# EAGLE design Retro_Lite_CM5_Left_PCB_v1 - RP2040 (EAGLE 9.6.1)
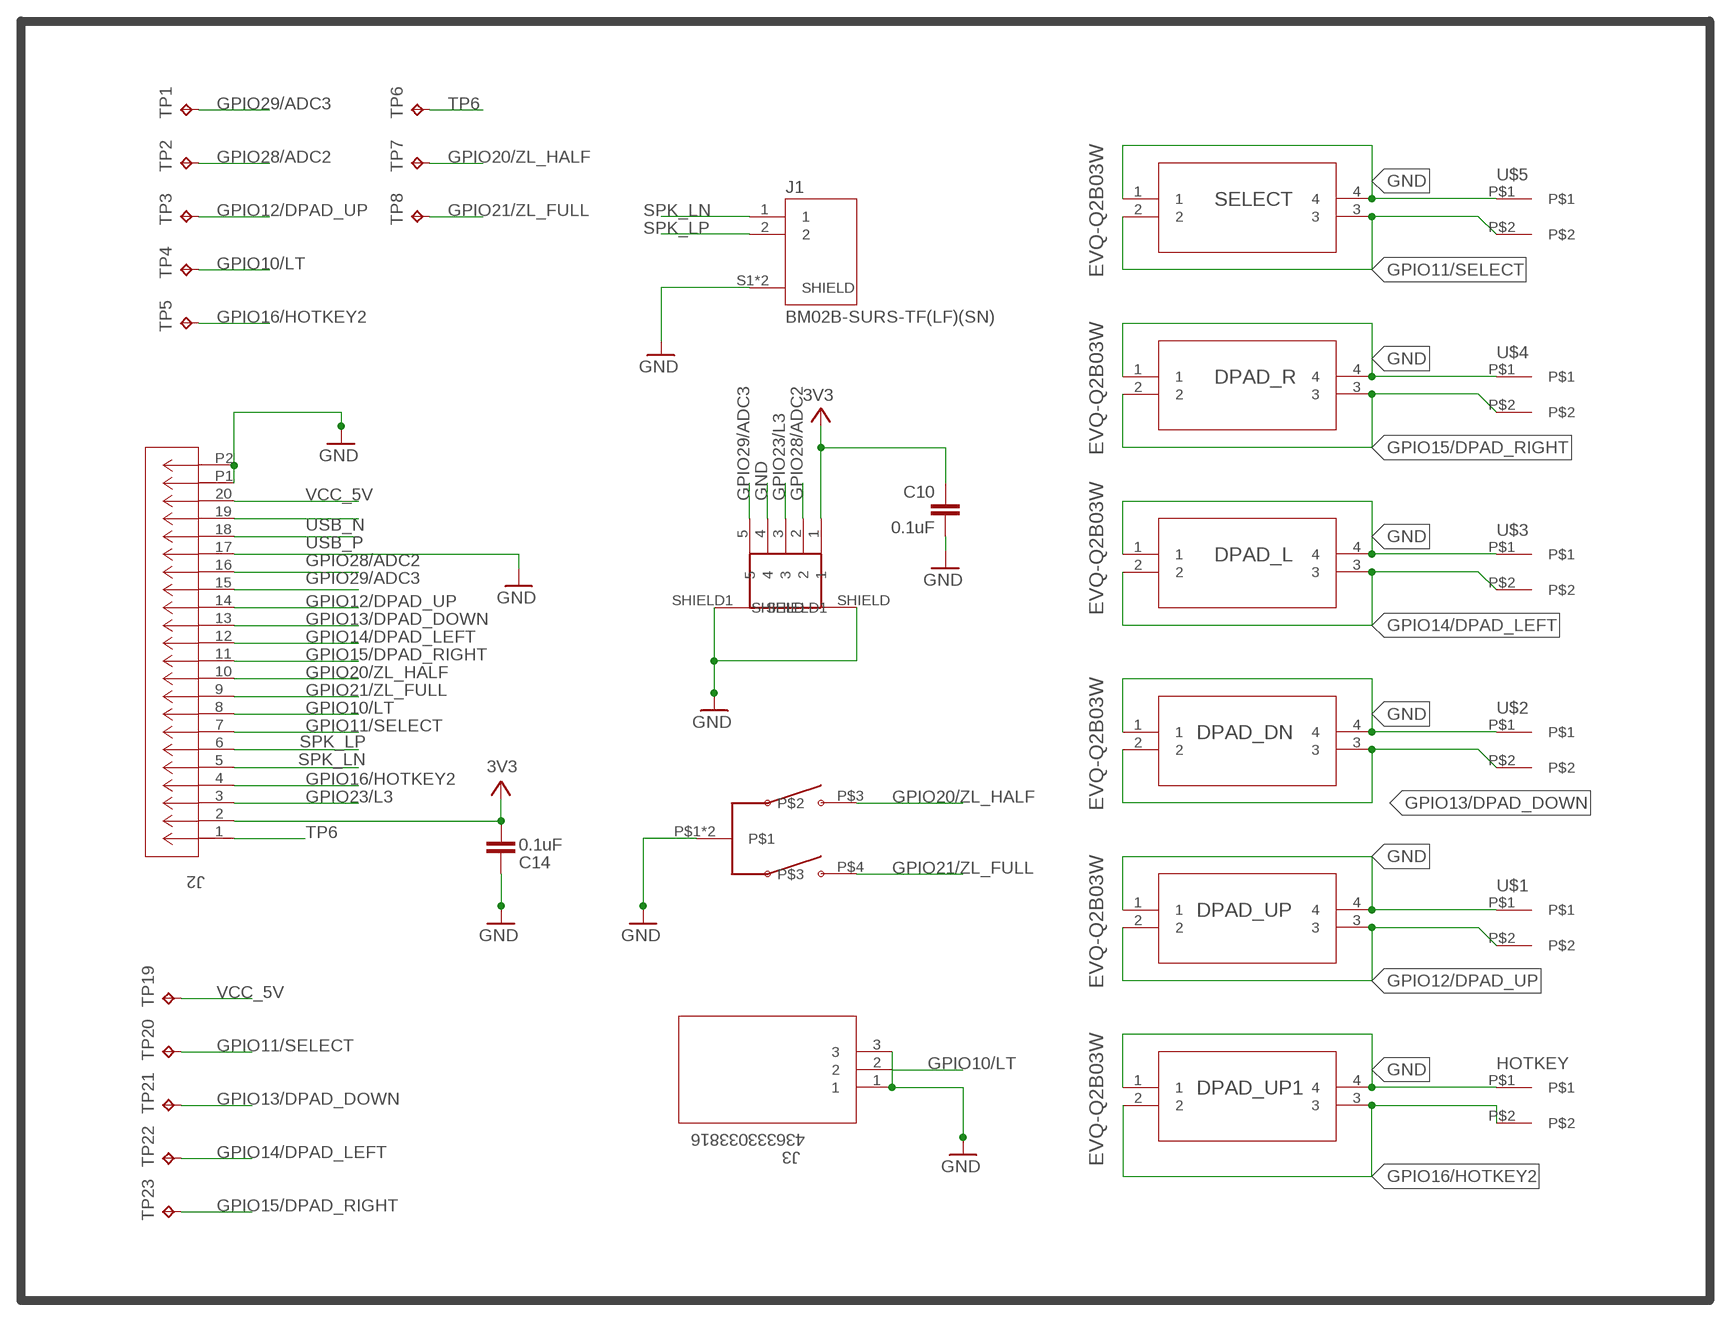
[diagram p0: schematic, sheet 1]

## Parts
C10  0.1uF  C-EUC0402-YVELTAL  [C0402]
C14  0.1uF  C-EUC0402-YVELTAL  [C0402]
DPAD_DN  EVQ-Q2B03W  [EVQQ2_3]
DPAD_L  EVQ-Q2B03W  [EVQQ2_3]
DPAD_R  EVQ-Q2B03W  [EVQQ2_3]
DPAD_UP  EVQ-Q2B03W  [EVQQ2_3]
DPAD_UP1  EVQ-Q2B03W  [EVQQ2_3]
HOTKEY  MEMBRANEBUTTON  [MEMBRANEBUTTON]
J1  BM02B-SURS-TF(LF)(SN)  [JST_BM02B-SURS-TF(LF)(SN)]
J2  5034802000  [CON_5034802000_MOL]
J3  436333033816  [CONN3_3033816_WRE]
SELECT  EVQ-Q2B03W  [EVQQ2_3]
TP1  TPTP07R  [TP07R]
TP2  TPTP07R  [TP07R]
TP3  TPTP07R  [TP07R]
TP4  TPTP07R  [TP07R]
TP5  TPTP07R  [TP07R]
TP6  TPTP07R  [TP07R]
TP7  TPTP07R  [TP07R]
TP8  TPTP07R  [TP07R]
TP19  TPTP07R  [TP07R]
TP20  TPTP07R  [TP07R]
TP21  TPTP07R  [TP07R]
TP22  TPTP07R  [TP07R]
TP23  TPTP07R  [TP07R]
U$1  MEMBRANEBUTTON  [MEMBRANEBUTTON]
U$2  MEMBRANEBUTTON  [MEMBRANEBUTTON]
U$3  MEMBRANEBUTTON  [MEMBRANEBUTTON]
U$4  MEMBRANEBUTTON  [MEMBRANEBUTTON]
U$5  MEMBRANEBUTTON  [MEMBRANEBUTTON]
U$7  SWITCHSTICK_BREAKOUT  [SWITCHSTICK_BREAKOUT]
U$8  TMHF07  [TMHF07]

## Nets
3V3: C10.1 C14.2 J2.2 U$7.1 ; supply symbol labelled VCC
GND: C10.2 C14.1 DPAD_DN.1 DPAD_DN.4 DPAD_L.1 DPAD_L.4 DPAD_R.1 DPAD_R.4 DPAD_UP1.1 DPAD_UP1.4 DPAD_UP.1 DPAD_UP.4 HOTKEY.P$1 J1.S1(SHIELD) J1.S2(SHIELD) J2.17 J2.P1 J2.P2 J3.1 J3.3 SELECT.1 SELECT.4 U$1.P$1 U$2.P$1 U$3.P$1 U$4.P$1 U$5.P$1 U$7.4 U$7.SHIELD U$7.SHIELD1 U$8.P$1 U$8.P$2
GPIO10/LT: J2.8 J3.2 TP4.TP
GPIO11/SELECT: J2.7 SELECT.2 SELECT.3 TP20.TP U$5.P$2
GPIO12/DPAD_UP: DPAD_UP.2 DPAD_UP.3 J2.14 TP3.TP U$1.P$2
GPIO13/DPAD_DOWN: DPAD_DN.2 DPAD_DN.3 J2.13 TP21.TP U$2.P$2
GPIO14/DPAD_LEFT: DPAD_L.2 DPAD_L.3 J2.12 TP22.TP U$3.P$2
GPIO15/DPAD_RIGHT: DPAD_R.2 DPAD_R.3 J2.11 TP23.TP U$4.P$2
GPIO16/HOTKEY2: DPAD_UP1.2 DPAD_UP1.3 HOTKEY.P$2 J2.4 TP5.TP
GPIO20/ZL_HALF: J2.10 TP7.TP U$8.P$3
GPIO21/ZL_FULL: J2.9 TP8.TP U$8.P$4
GPIO23/L3: J2.3 U$7.3
GPIO28/ADC2: J2.16 TP2.TP U$7.2
GPIO29/ADC3: J2.15 TP1.TP U$7.5
SPK_LN: J1.1 J2.5
SPK_LP: J1.2 J2.6
TP6: J2.1 TP6.TP
USB_N [USB2.0]: J2.19
USB_P [USB2.0]: J2.18
VCC_5V: J2.20 TP19.TP

## Library data of the parts
C10 C14 = rcl:C-EU: CAPACITOR, European symbol
DPAD_DN DPAD_L DPAD_R DPAD_UP DPAD_UP1 SELECT = EVQ-Q2B03W:EVQ-Q2B03W; AVAILABILITY: Unavailable; DESCRIPTION: Tactile Switch SPST-NO Top Actuated Surface Mount; MF: Panasonic Electronic; MP: EVQQ2B03W; PACKAGE: None; PRICE: None
HOTKEY U$1-U$5 = Membrane Button:MEMBRANEBUTTON
J1 = BM02B-SURS-TF_LF__SN_:BM02B-SURS-TF(LF)(SN): Connector Header Surface Mount 2 position 0.031" (0.80mm); CHECK_PRICES: https://www.snapeda.com/parts/BM02B-SURS-TF(LF)(SN)/JST+Sales+America+Inc./view-part/?ref=eda; DESCRIPTION: Connector Header Surface Mount 2 position 0.031 (0.80mm); MF: JST Sales; MP: BM02B-SURS-TF(LF)(SN); PACKAGE: None; SNAPEDA_LINK: https://www.snapeda.com/parts/BM02B-SURS-TF(LF)(SN)/JST+Sales+America+Inc./view-part/?ref=snap
J2 = 5034801700:5034802000; COPYRIGHT: Copyright (C) 2023 Ultra Librarian. All rights reserved.; MANUFACTURER_PART_NUMBER: 5034802000; MFR_NAME: Molex Connector Corporation
J3 = 5034801700:436333033816; COPYRIGHT: Copyright (C) 2023 Ultra Librarian. All rights reserved.; MANUFACTURER_PART_NUMBER: 436333033816; MFR_NAME: Wurth Electronics
TP1-TP8 TP19-TP23 = testpad:TP: Test pad
U$7 = My_Stuff:SWITCHSTICK_BREAKOUT
U$8 = tmhf07:TMHF07

## Net classes
1 USB2.0: width 0.192 mm, clearance 0.114 mm
2 USBEXT: width 0.254 mm

## Board
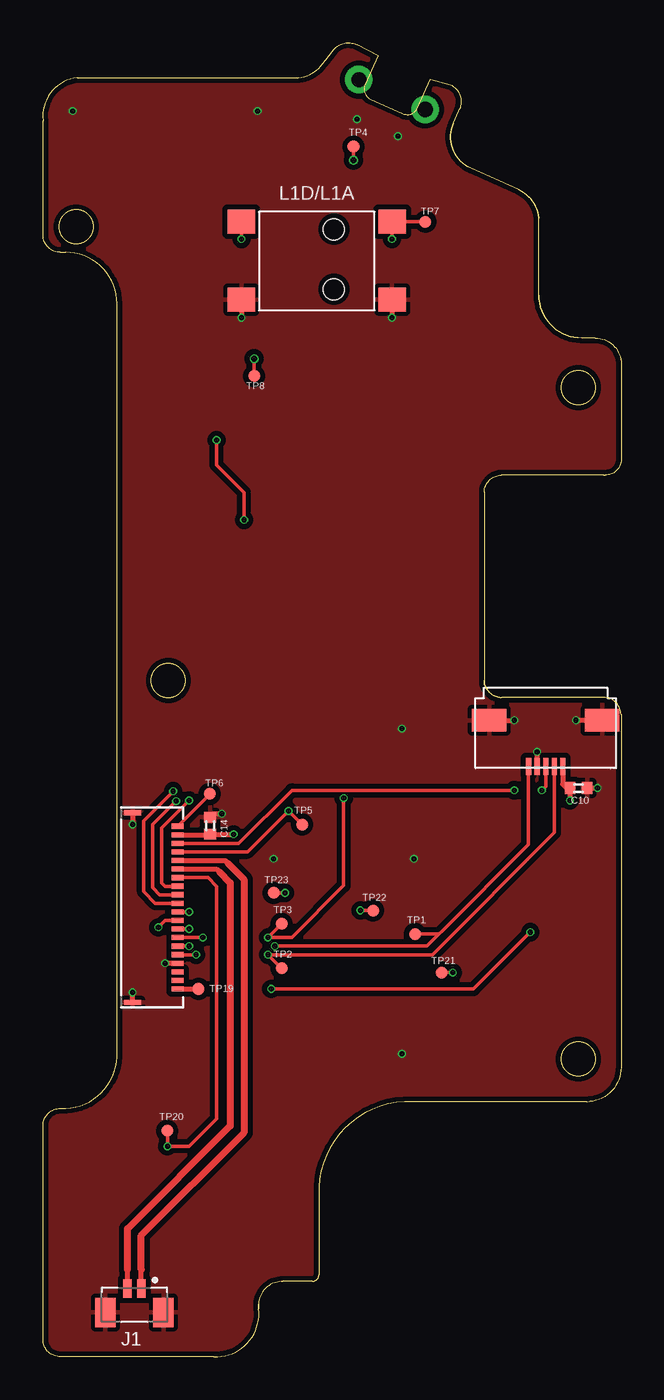
[diagram p1: board, top side]
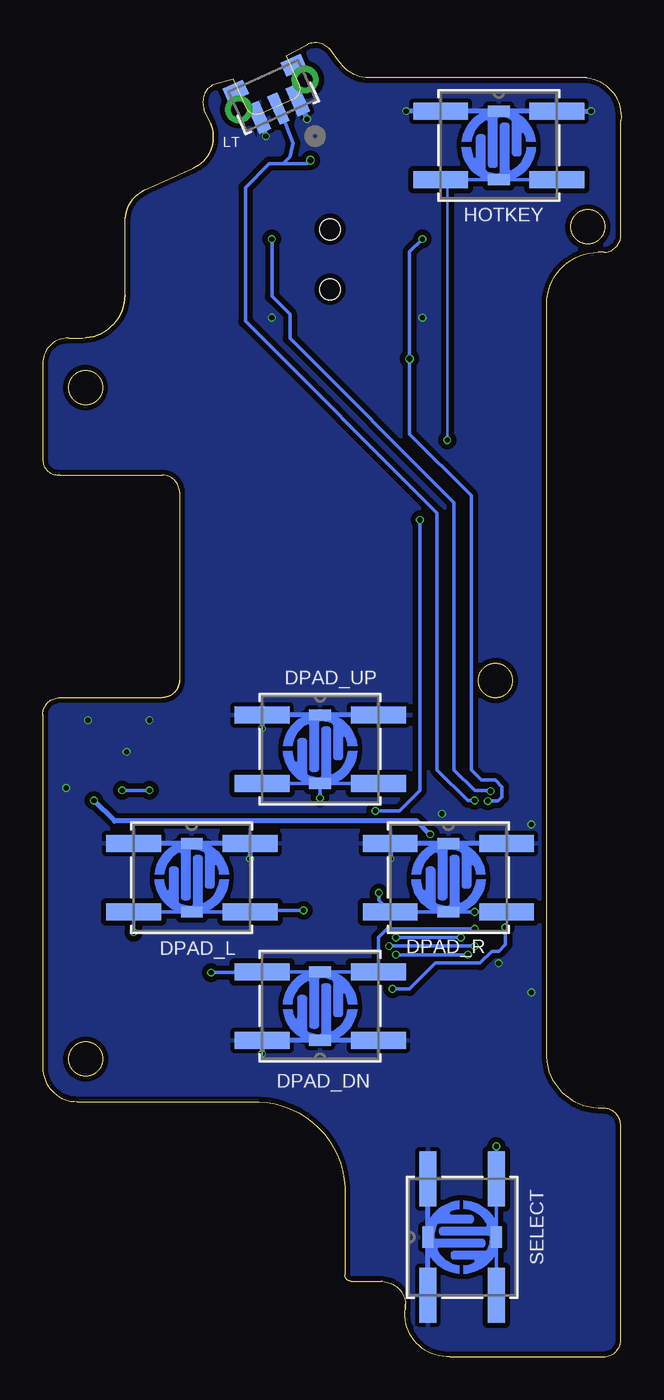
[diagram p2: board, bottom side, seen from below]

Size 33.79 x 76.74 mm. Coordinates in mm from the lower left corner, seen from the top.
Outline: 24.85,69.49 arc-85 24,72.05
Outline: 27.81,68.16 arc-60 28.98,66.5
Outline: 31.27,59.51 arc-85 28.99,62
Outline: 26.7,38.5 arc-80 25.79,39.49
Outline: 24,72.05 arc85 24.85,69.49
Outline: 27.81,68.16 arc-60 28.98,66.5
Outline: 28.99,62 arc85 31.27,59.51
Outline: 25.79,39.49 25.79,50.49 arc-85 26.79,51.49 32.79,51.49 32.87,51.5 arc85 33.79,52.29 33.79,58.13 33.77,58.26 arc80 32.29,59.5 31.49,59.5 31.27,59.51
Outline: 25.79,39.49 arc80 26.7,38.5
Outline: 26.7,38.5 26.79,38.49 32.79,38.49 arc-85 33.78,37.58 33.79,37.49 33.79,16.89 arc-85 31.96,14.9 31.79,14.89 21.14,14.89 arc85 16.14,9.89 16.14,4.79 arc-85 15.77,4.39 13.99,4.39 13.94,4.39 arc85 12.6,3.06
Outline: 12.6,3.06 12.59,2.94
Outline: 12.59,2.94 12.61,2.82
Outline: 12.61,2.81 12.61,2.8
Outline: 12.61,2.8 arc-55 11.79,0.64 arc-45 9.99,0 1.01,0 arc-85 0.02,0.92 0.01,1 0.01,13.5 arc-80 0.84,14.48 0.93,14.5 1.01,14.5 1.34,14.5 arc85 4.34,17.5 4.34,61.5 arc85 1.6,64.49 1.34,64.5 1.01,64.5 arc-90 0.01,65.5 0.01,72.2 arc-90 2.01,74.7 14.61,74.7 arc55 16.24,75.38 16.53,75.73 16.92,76.25 arc-80 18.35,76.63 19.59,76 18.82,74.3 arc90 19.14,73.46 21.04,72.6 arc90 21.88,72.92 22.64,74.62 23.82,74.3 arc-85 24.35,72.86 24.32,72.78 24,72.05
Outline: 12.61,2.8 12.61,2.81
Outline: 12.61,2.81 12.61,2.82
Outline: 12.61,2.82 12.59,2.94
Outline: 12.59,2.94 12.6,3.06
Outline: 28.99,62 arc85 31.27,59.51
Outline: 28.99,62 28.99,66.33 28.98,66.5
Outline: 28.98,66.5 arc60 27.81,68.16
Outline: 27.81,68.16 25,69.41 24.85,69.49
Outline: 24,72.05 arc85 24.85,69.49
Outline: circle at 31.29,56.6 radius 1
Outline: circle at 7.33,39.49 radius 1
Outline: circle at 31.29,17.38 radius 1
Outline: circle at 1.95,65.99 radius 1
Copper layers (1*16): Top 0.035mm / dielectric 1.6mm / Bottom 0.035mm
Design rules "jlcpcb-2layers *": minimum track width 5mil, minimum drill 0.3mm, track to track 5mil, track to pad 5mil, pad to pad 5mil, via to via 5mil, smd to smd 5mil, copper to edge 0.2mm, drill to drill 6mil, minimum pad ring 10mil, minimum via ring 3mil, stop-mask expansion 0mil, vias tented up to drill 100mil, thermal gap 10mil

### Footprints (pad centres in the part's own frame; a part is rotated, then mirrored left to right if it is on the bottom)
C0402 = smd 0.6 x 0.7: 1 -0.5,0; 2 0.5,0
EVQQ2_3 = smd 3.2 x 0.991: 1 -3.4,2; 2 -3.4,-2; 3 3.4,-2; 4 3.4,2
MEMBRANEBUTTON = smd 0.635 x 1.27: P$1 2,0; P$2 -2,0
JST_BM02B-SURS-TF(LF)(SN) = smd 0.5 x 1.1: 1 -0.4,0; 2 0.4,0 | smd 1.2 x 1.7: S1 -1.7,1.4; S2 1.7,1.4
CON_5034802000_MOL = smd 0.3 x 0.7: 1 -4.75,1.5; 2 -4.25,1.5; 3 -3.75,1.5; 4 -3.25,1.5; 5 -2.75,1.5; 6 -2.25,1.5; 7 -1.75,1.5; 8 -1.25,1.5; 9 -0.75,1.5; 10 -0.25,1.5; 11 0.25,1.5; 12 0.75,1.5; 13 1.25,1.5; 14 1.75,1.5; 15 2.25,1.5; 16 2.75,1.5; 17 3.25,1.5; 18 3.75,1.5; 19 4.25,1.5; 20 4.75,1.5 | smd 0.3 x 1: P1 -5.54,-1.15; P2 5.54,-1.15
CONN3_3033816_WRE = smd 0.762 x 1.803: 1 0.056,-0.441; 3 2.545,-0.441 | smd 0.61 x 1.803: 2 1.3,-0.441 | smd 1.295 x 0.889: 4 -0.55,-2.395; 5 3.15,-2.395 | drill 0.889 pad 0.889: 6 -0.813,-1.346; 7 3.429,-1.346
TP07R = smd 0.7 x 0.7: TP 0,0
SWITCHSTICK_BREAKOUT = smd 0.3 x 1: 1 0,0; 2 0.5,0; 3 1,0; 4 1.5,0; 5 2,0 | smd 2 x 1.3: SHIELD -2.3,-2.7; SHIELD1 4.3,-2.7
TMHF07 = smd 1.6 x 1.4: P$1 -4.4,2.25; P$2 4.4,2.25; P$3 -4.4,-2.3; P$4 4.4,-2.3 | hole 1.2: -1,1.65; -1,-1.85

### Placement (x,y rotation side)
C10  31.3,33.21 0 top
C14  9.78,31.01 270 top
DPAD_DN  17.58,20.48 180 bottom
DPAD_L  25.08,27.98 0 bottom
DPAD_R  10.08,27.98 0 bottom
DPAD_UP  17.58,35.48 0 bottom
DPAD_UP1  7.14,70.75 0 bottom
HOTKEY  7.14,70.75 90 bottom
J1  5.35,3.98 180 top
J2  6.39,26.23 270 top
J3  18.66,73.03 204.2 bottom
SELECT  9.28,6.98 90 bottom
TP1  21.75,24.68 0 top
TP2  13.95,22.68 0 top
TP3  13.95,25.28 0 top
TP4  18.15,70.68 0 top
TP5  15.15,31.08 0 top
TP6  9.75,32.88 0 top
TP7  22.35,66.28 0 top
TP8  12.35,57.28 0 top
TP19  9.09,21.48 0 top
TP20  7.28,13.2 0 top
TP21  23.3,22.44 0 top
TP22  19.3,26.06 0 top
TP23  13.5,27.09 0 top
U$1  17.58,35.48 90 bottom
U$2  17.58,20.48 270 bottom
U$3  25.08,27.98 90 bottom
U$4  10.08,27.98 90 bottom
U$5  9.28,6.98 180 bottom
U$7  30.38,34.47 180 top
U$8  16.01,63.99 180 top

### Tracks (layer width: path | path; a pad name or v marks a point on that pad's centre or on a via)
3V3  (via drill 0.3)
  Top 0.305: U$7.1 30.38,33.44 30.62,33.21 C10.1 v30.8,32.48 | J2.2 9.75,30.48 C14.2 v11.15,30.51
  Bottom 0.305: v11.15,30.51 11.92,31.28 29.6,31.28 v30.8,32.48
GND  (via drill 0.3)
  Top 0.305: C10.2 v32.41,33.21 | U$7.SHIELD1 v27.55,37.17 | U$7.SHIELD v31.15,37.17 | U$7.4 v28.88,35.33 | v10.46,31.71 9.98,31.71 C14.1 | J2.17 v7.15,22.98 | J2.P2 v5.24,21.28 | J2.P1 v5.24,31.08 | U$8.P$1 v20.41,60.68 | U$8.P$2 v11.61,60.68
  Bottom 0.305: DPAD_R.4 U$4.P$1 DPAD_R.1 v13.48,29.08 | DPAD_L.1 U$3.P$1 DPAD_L.4 v21.68,29.08 | DPAD_DN.1 U$2.P$1 DPAD_DN.4 v20.98,17.68 | SELECT.1 U$5.P$1 SELECT.4 | DPAD_UP.4 U$1.P$1 DPAD_UP.1 v20.98,36.68 | v12.55,72.75 DPAD_UP1.1 HOTKEY.P$1 DPAD_UP1.4 v1.75,72.75 | J3.1 v18.35,72.28 | J3.3 v20.75,71.28
  pour Top (isolate 0.305): -9.65,77.48 -9.65,-5.52 39.35,-5.52 39.35,77.48
  pour Bottom (isolate 0.305): -13.05,81.48 -13.05,-9.02 42.85,-9.02 42.85,81.48
GPIO10/LT  (via drill 0.3, 0.35)
  Top 0.203: J2.8 7.15,27.48 6.95,27.68 6.95,30.88 v8.55,32.48 | TP4.TP v18.15,69.88
  Bottom 0.203: J3.2 19.56,71.88 19.52,71.78 19.15,70.88 19.35,70.08 19.75,69.68 | v8.55,32.48 8.95,32.48 10.75,34.28 10.75,49.28 21.95,60.48 21.95,68.28 20.55,69.68 19.75,69.68 | v18.15,69.88 18.35,69.68 19.75,69.68
GPIO11/SELECT  (via drill 0.3)
  Top 0.203: J2.7 9.65,27.98 10.15,27.48 10.15,13.88 8.55,12.28 v7.28,12.28 TP20.TP
  Bottom 0.203: SELECT.2 U$5.P$2 SELECT.3 v7.28,12.28
GPIO12/DPAD_UP  (via drill 0.3)
  Top 0.203: J2.14 | J2.14 v9.35,24.48 | v17.58,32.63 17.58,27.51 14.55,24.48 v13.15,24.48 TP3.TP
  Bottom 0.203: U$1.P$2 DPAD_UP.2 | v9.35,24.48 v13.15,24.48 | DPAD_UP.3 U$1.P$2 | U$1.P$2 v17.58,32.63
GPIO13/DPAD_DOWN  (via drill 0.3)
  Top 0.203: TP21.TP v23.95,22.44 | J2.13 v8.55,24.98
  Bottom 0.152: 14.18,22.88 DPAD_DN.2
  Bottom 0.203: v8.55,24.98 13.68,24.98 14.18,24.48 14.18,22.88 | DPAD_DN.2 U$2.P$2 DPAD_DN.3 21.03,22.44 v23.95,22.44
GPIO14/DPAD_LEFT  (via drill 0.3)
  Top 0.203: J2.12 7.15,25.48 v6.75,25.08 | v13.35,21.48 25.16,21.48 v28.48,24.8 | TP22.TP v18.55,26.06
  Bottom 0.203: v6.75,25.08 6.75,24.08 7.15,23.68 7.55,23.68 8.25,22.99 10.85,22.99 12.35,21.48 v13.35,21.48 | v28.48,24.8 DPAD_L.2 U$3.P$2 DPAD_L.3 21.6,26.06 v18.55,26.06
GPIO15/DPAD_RIGHT  (via drill 0.3)
  Top 0.203: J2.11 | J2.11 v8.55,25.98 | TP23.TP v14.15,27.09
  Bottom 0.203: DPAD_R.3 v8.55,25.98 U$4.P$2 DPAD_R.2 14.15,26.65 v14.15,27.09
GPIO16/HOTKEY2  (via drill 0.3)
  Top 0.203: J2.4 11.95,29.48 v14.35,31.88 TP5.TP | v11.75,48.88 11.75,50.48 10.15,52.08 v10.15,53.54
  Bottom 0.152: 10.15,68.75 v10.15,53.54
  Bottom 0.203: DPAD_UP1.3 HOTKEY.P$2 10.15,68.75 DPAD_UP1.2 | v14.35,31.88 12.95,31.88 11.75,33.08 v11.75,48.88
GPIO20/ZL_HALF  (via drill 0.3)
  Top 0.203: J2.10 | J2.10 6.58,26.48 5.89,27.16 5.89,31.29 7.62,33.02 v7.62,33.03 | v20.41,65.28 U$8.P$3 20.42,66.28 TP7.TP
  Bottom 0.203: v7.62,33.03 7.67,33.08 8.55,33.08 9.75,34.28 9.75,49.88 19.35,59.48 19.35,60.88 20.41,61.93 v20.41,65.28
GPIO21/ZL_FULL  (via drill 0.3, 0.35)
  Top 0.203: J2.9 6.84,26.98 6.42,27.4 6.42,31.09 v7.78,32.45 | U$8.P$4 v11.61,65.28 | TP8.TP v12.35,58.28
  Bottom 0.203: v7.78,32.45 7.18,32.45 6.95,32.68 6.95,33.28 7.35,33.68 8.15,33.68 8.75,34.28 8.75,50.28 12.35,53.88 v12.35,58.28 12.35,64.53 v11.61,65.28
GPIO23/L3  (via drill 0.3)
  Top 0.152: 11.45,29.98
  Top 0.203: J2.3 11.45,29.98 14.55,33.08 v27.55,33.08 | v29.15,33.08 29.38,33.31 U$7.3
  Bottom 0.203: v27.55,33.08 v29.15,33.08
GPIO28/ADC2  (via drill 0.3)
  Top 0.203: U$7.2 29.88,30.61 22.75,23.48 | 22.75,23.48 | 22.75,23.48 v13.15,23.48 TP2.TP | v8.95,23.48 | v8.95,23.48 J2.16
  Bottom 0.203: v13.15,23.48 v8.95,23.48
GPIO29/ADC3  (via drill 0.3)
  Top 0.203: U$7.5 28.38,29.91 23.35,24.88 23.15,24.68 | v13.55,23.98 22.45,23.98 23.15,24.68 | J2.15 v8.55,23.98 | TP1.TP 23.15,24.68
  Bottom 0.203: v8.55,23.98 v13.55,23.98
SPK_LN
  Top 0.305: 10.85,28.78 10.65,28.98 J2.5 | J1.1 5.75,5.08
  Top 0.406: 5.75,5.08 5.75,7.08 11.75,13.08 11.75,27.88 10.85,28.78
SPK_LP
  Top 0.305: J2.6 10.15,28.48 10.35,28.28 | J1.2 4.95,5.08
  Top 0.406: 4.95,5.08 4.95,7.48 10.95,13.48 10.95,27.68 10.35,28.28
TP6
  Top 0.203: J2.1 9.75,32.84 TP6.TP
VCC_5V
  Top 0.305: J2.20 TP19.TP

### Text on the board
tPlace: L1D/L1A
bPlace: LT